# EAGLE design MainBoard (EAGLE 8.4.0)
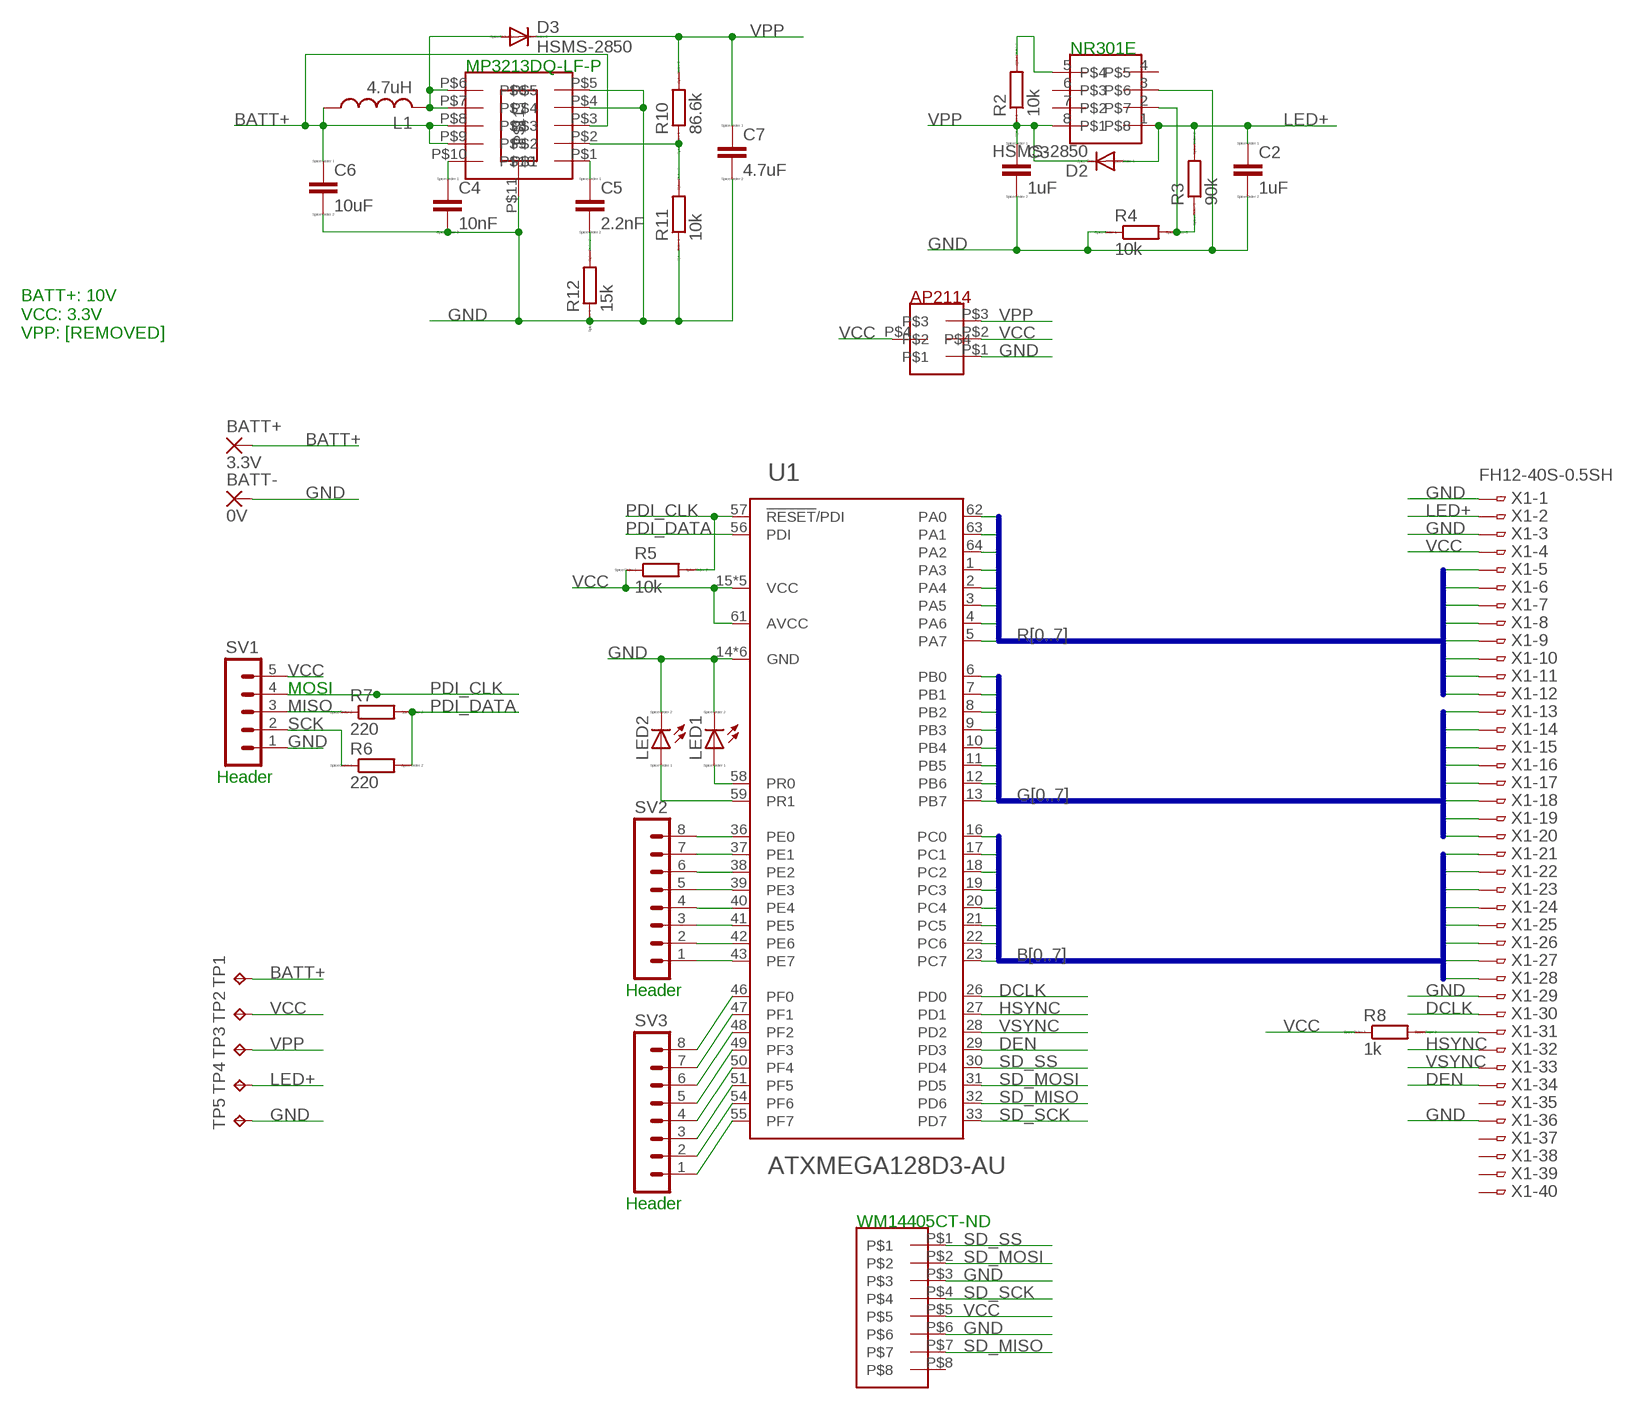
[diagram p0: schematic, sheet 1]

## Parts
BATT+  3.3V  2,54/1,1  [2,54/1,1]
BATT-  0V  2,54/1,1  [2,54/1,1]
C2  1uF  CC0402  [C0402]
C3  1uF  CC0402  [C0402]
C4  10nF  CC0402  [C0402]
C5  2.2nF  CC0402  [C0402]
C6  10uF  CC0402  [C0402]
C7  4.7uF  CC0402  [C0402]
D2  HSMS-2850  [SOT23]
D3  HSMS-2850  [SOT23]
L1  4.7uH  L-USL3225M  [L3225M]
LED1  LED_ESML0603  [LED_SML0603]
LED2  LED_ESML0603  [LED_SML0603]
R2  10k  RR0402  [R0402]
R3  90k  RR0402  [R0402]
R4  10k  RR0402  [R0402]
R5  10k  RR0402  [R0402]
R6  220  RR0402  [R0402]
R7  220  RR0402  [R0402]
R8  1k  RR0402  [R0402]
R10  86.6k  RR0402  [R0402]
R11  10k  RR0402  [R0402]
R12  15k  RR0402  [R0402]
SV1  MA05-1  [MA05-1]
SV2  MA08-1  [MA08-1]
SV3  MA08-1  [MA08-1]
TP1  TPPAD1-17  [P1-17]
TP2  TPPAD1-17  [P1-17]
TP3  TPPAD1-17  [P1-17]
TP4  TPPAD1-17  [P1-17]
TP5  TPPAD1-17  [P1-17]
U1  ATXMEGA128D3-AU  [TQFP-64A-64]
U$1  SOIC-8  [SOIC-8]
U$2  AP2114H  [SOT233]
U$3  MICROSD  [MICROSD]
U$4  QFN-10  [QFN-10]
X1  FH12-40S-0.5SH  [FH12-40S-0.5SH]

## Nets
B0: U1.16(PC0) X1.21
B1: U1.17(PC1) X1.22
B2: U1.18(PC2) X1.23
B3: U1.19(PC3) X1.24
B4: U1.20(PC4) X1.25
B5: U1.21(PC5) X1.26
B6: U1.22(PC6) X1.27
B7: U1.23(PC7) X1.28
BATT+: BATT+.1(P) C6.1 L1.1 TP1.TP U$4.P$3 U$4.P$8 U$4.P$9
DCLK: U1.26(PD0) X1.30
DEN: U1.29(PD3) X1.34
G0: U1.6(PB0) X1.13
G1: U1.7(PB1) X1.14
G2: U1.8(PB2) X1.15
G3: U1.9(PB3) X1.16
G4: U1.10(PB4) X1.17
G5: U1.11(PB5) X1.18
G6: U1.12(PB6) X1.19
G7: U1.13(PB7) X1.20
GND: BATT-.1(P) C2.2 C3.2 C4.2 C6.2 C7.2 LED1.C LED2.C R4.1 R11.1 R12.1 SV1.1 TP5.TP U1.14(GND) U1.24(GND) U1.34(GND) U1.44(GND) U1.52(GND) U1.60(GND) U$1.3 U$2.P$1 U$3.P$3 U$3.P$6 U$4.P$4 U$4.P$5 U$4.P$11 X1.1 X1.3 X1.29 X1.36
HSYNC: U1.27(PD1) X1.32
LED+: C2.1 D2.1(A) R3.2 TP4.TP U$1.1 X1.2
MISO: R7.1 SV1.3
N$3: R2.2 U$1.5
N$4: R3.1 R4.2 U$1.2
N$5: SV2.8 U1.36(PE0)
N$6: SV2.7 U1.37(PE1)
N$7: SV2.6 U1.38(PE2)
N$8: SV2.5 U1.39(PE3)
N$9: SV2.4 U1.40(PE4)
N$10: SV2.3 U1.41(PE5)
N$11: SV2.2 U1.42(PE6)
N$12: SV2.1 U1.43(PE7)
N$13: LED1.A U1.58(PR0)
N$14: LED2.A U1.59(PR1)
N$15: D3.1(A) L1.2 U$4.P$6 U$4.P$7
N$17: R8.2 X1.31
N$18: SV3.8 U1.46(PF0)
N$19: SV3.7 U1.47(PF1)
N$20: SV3.6 U1.48(PF2)
N$21: SV3.5 U1.49(PF3)
N$22: SV3.4 U1.50(PF4)
N$23: SV3.3 U1.51(PF5)
N$24: SV3.2 U1.54(PF6)
N$25: SV3.1 U1.55(PF7)
N$27: C4.1 U$4.P$10
N$28: R10.1 R11.2 U$4.P$2
N$30: C5.1 U$4.P$1
N$31: C5.2 R12.2
PDI_CLK: R5.2 SV1.4 U1.57(!RESET!/PDI)
PDI_DATA: R6.2 R7.2 U1.56(PDI)
R0: U1.62(PA0) X1.5
R1: U1.63(PA1) X1.6
R2: U1.64(PA2) X1.7
R3: U1.1(PA3) X1.8
R4: U1.2(PA4) X1.9
R5: U1.3(PA5) X1.10
R6: U1.4(PA6) X1.11
R7: U1.5(PA7) X1.12
SCK: R6.1 SV1.2
SD_MISO: U1.32(PD6) U$3.P$7
SD_MOSI: U1.31(PD5) U$3.P$2
SD_SCK: U1.33(PD7) U$3.P$4
SD_SS: U1.30(PD4) U$3.P$1
VCC: R5.1 R8.1 SV1.5 TP2.TP U1.15(VCC) U1.25(VCC) U1.35(VCC) U1.45(VCC) U1.53(VCC) U1.61(AVCC) U$2.P$2 U$2.P$4 U$3.P$5 X1.4
VPP: C3.1 C7.1 D2.3(C) D3.3(C) R2.1 R10.2 TP3.TP U$1.8 U$2.P$3
VSYNC: U1.28(PD2) X1.33
Unconnected: U$1.4 U$1.6 U$1.7 U$3.P$8 X1.35 X1.37 X1.38 X1.39 X1.40

## Buses
R[0..7]
G[0..7]
B[0..7]

## Notes on the sheet
- NR301E
- MP3213DQ-LF-P
- BATT+: 10V
  VCC: 3.3V
  VPP: [REMOVED]
- MOSI
- Header
- Header
- Header
- WM14405CT-ND

## Library data of the parts
BATT+ BATT- = wirepad:2,54/1,1: THROUGH-HOLE PAD
C2-C7 = eagle-ltspice:C: CAPACITOR, European symbol; SPICEMODEL: NONE; SPICEPREFIX: C
D2 D3 = avago:HSMS-2850: Surface Mount Microwave Schottky Detector Diodes Source: Data sheet <http://www.farnell.com/datasheets/461166.pdf>
L1 = resistor:L-US: INDUCTOR, American symbol
LED1 LED2 = eagle-ltspice:LED_E: LED Source: http://www.osram.convergy.de Source: www.luxeon.com Source: www.kingbright.com; SPICEMODEL: NONE; SPICEPREFIX: D; SPICETYPE: diode
R2-R8 R10-R12 = eagle-ltspice:R: RESISTOR, European symbol; SPICEMODEL: NONE; SPICEPREFIX: R
SV1 = con-lstb:MA05-1: PIN HEADER; OC_FARNELL: unknown; OC_NEWARK: unknown
SV2 SV3 = con-lstb:MA08-1: PIN HEADER; OC_FARNELL: unknown; OC_NEWARK: unknown
TP1-TP5 = testpad:TP: Test pad
U1 = atmel-xmega:ATXMEGA128D3: 8/16-bit XMEGA C3 Microcontroller Features High-performance, Low-power 8/16-bit Atmel® AVR® XMEGATM Microcontroller Non-volatile Program and Data Memories – 64K - 256K Bytes of In-System Self-Programmable Flash – 4K - 8K Bytes Boot Code Section with Independent Lock Bits – 2K - 4K Bytes EEPROM – 4K - 16K Bytes Internal SRAM Peripheral Features – Four-channel Event System – Five 16-bit Timer/Counters Four Timer/Counters with 4 Output Compare or Input Capture channels One Timer/Counters with 2 Output Compare or Input Capture channels High Resolution Extensions on two Timer/Counters Advanced Waveform Extension on one Timer/Counter – Three USARTs IrDA Extension on 1 USART – Two Two-Wire Interfaces with dual address match(I2C and SMBus compatible) – Two SPI (Serial Peripheral Interfaces) – 16-bit Real Time Counter with Separate Oscillator – One Sixteen-channel, 12-bit, 200ksps Analog to Digital Converter – Two Analog Comparators with Window compare function – External Interrupts on all General Purpose I/O pins – Programmable Watchdog Timer with Separate On-chip Ultra Low Power Oscillator Special Microcontroller Features – Power-on Reset and Programmable Brown-out Detection – Internal and External Clock Options with PLL – Programmable Multi-level Interrupt Controller – Sleep Modes: Idle, Power-down, Standby, Power-save, Extended Standby – Advanced Programming, Test and Debugging Interface PDI (Program and Debug Interface) for programming, test and debugging I/O and Packages – 50 Programmable I/O Lines – 64-lead TQFP – 64-pad QFN Operating Voltage – 1.6 – 3.6V Speed performance – 0 – 12 MHz @ 1.6 – 3.6V – 0 – 32 MHz @ 2.7 – 3.6V
U$1 = smd-footprints:SOIC-8
U$2 = ElectronicBadge:AP2114H
U$3 = ElectronicBadge:MICROSD
U$4 = smd-footprints:QFN-10
X1 = con-hirose:FH12-40S-0.5S: 0.5mm Pitch Connectors For FPC/FFC Source: Data sheet <http://www.hirose.co.jp/cataloge_hp/e58605370.pdf>; MPN: FH12-40S-0.5SH(55); OC_FARNELL: 1324556; OC_NEWARK: 34M6178

## Board
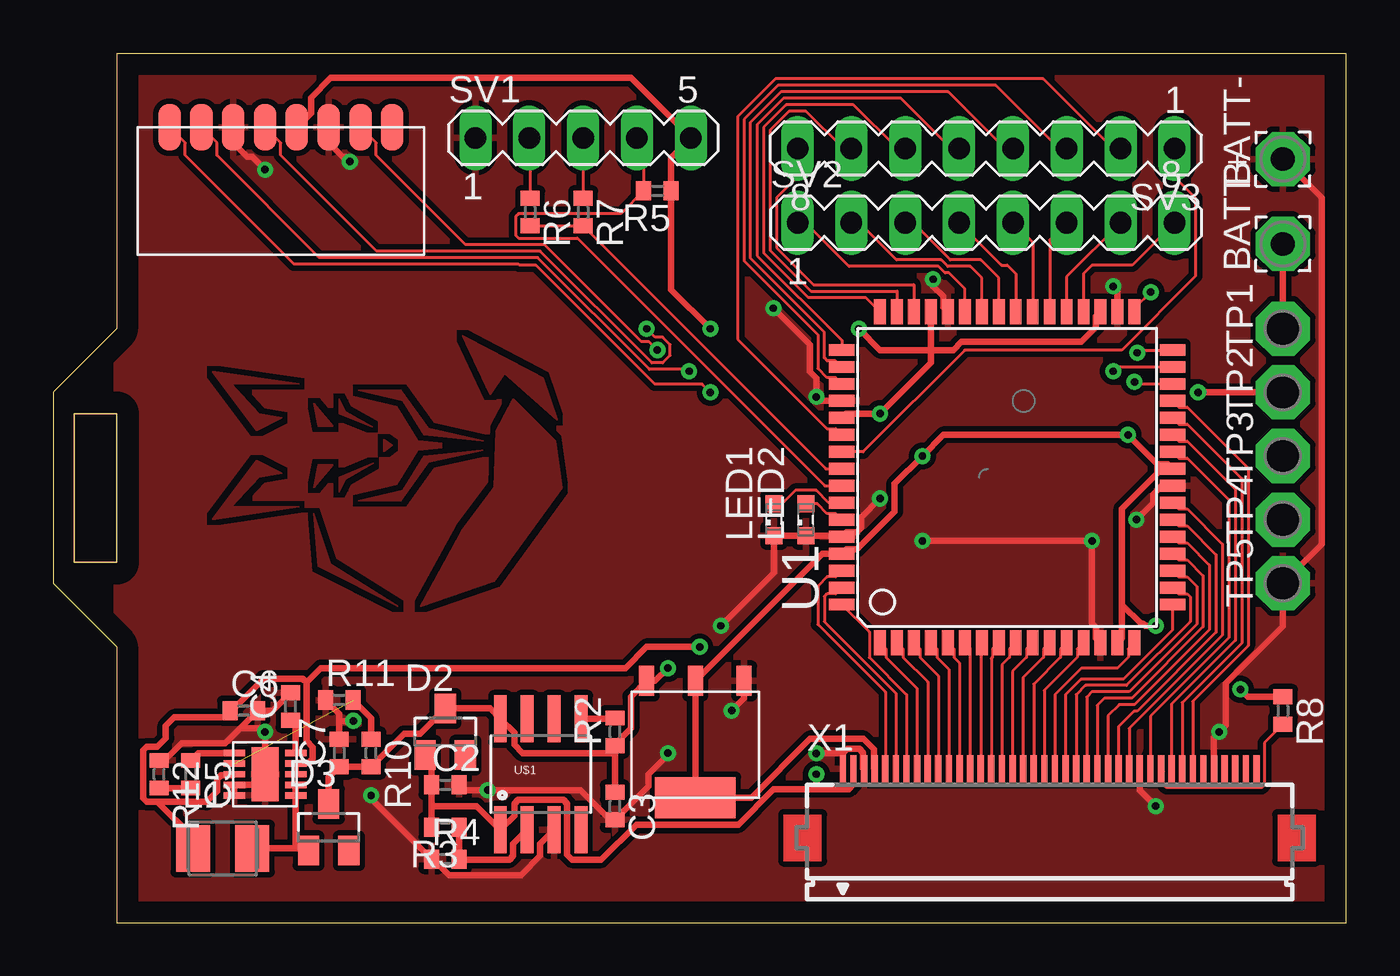
[diagram p1: board, top side]
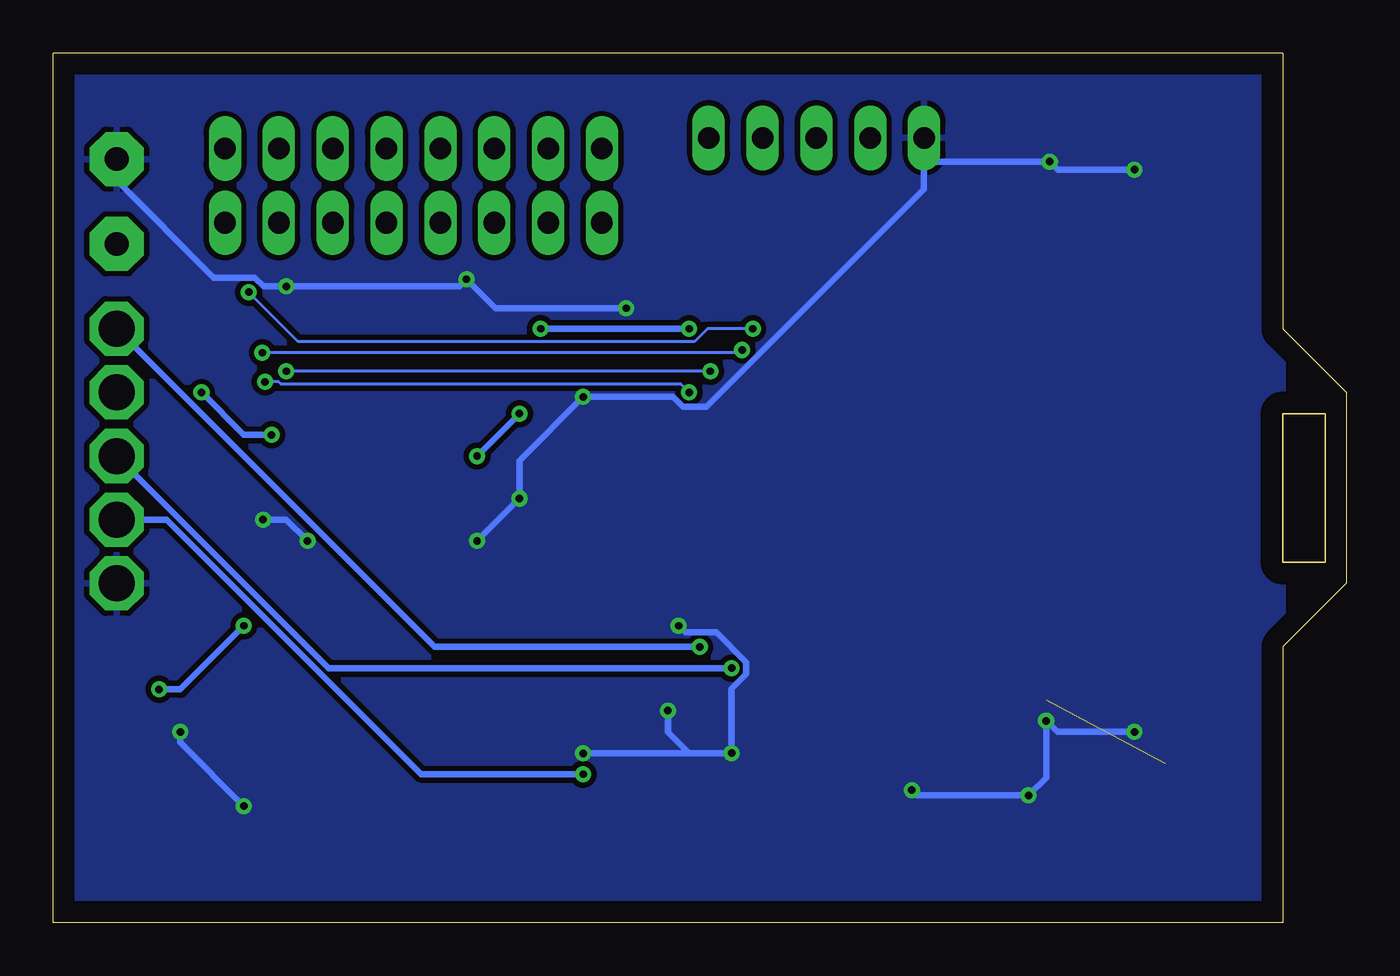
[diagram p2: board, bottom side, seen from below]

Size 61 x 41 mm. Coordinates in mm from the lower left corner, seen from the top.
Outline: 3,0 61,0 61,41 3,41 3,28 0,25 0,16 3,13 3,0
Outline: 1,24 1,17 3,17 3,24 1,24
Copper layers (1*16): Top 0.035mm / dielectric 1.5mm / Bottom 0.035mm
Design rules "default": minimum track width 6mil, minimum drill 0.35mm, track to track 6mil, track to pad 6mil, pad to pad 6mil, via to via 6mil, smd to smd 6mil, copper to edge 40mil, drill to drill 6mil, minimum pad ring 10mil, minimum via ring 8mil, stop-mask expansion 4mil, vias tented up to drill 0mil, thermal gap 10mil

### Footprints (pad centres in the part's own frame; a part is rotated, then mirrored left to right if it is on the bottom)
2,54/1,1 = drill 1.118 pad 2.54 octagon: 1 0,0
C0402 = smd 0.7 x 0.9: 1 -0.65,0; 2 0.65,0
SOT23 = smd 1 x 1.4: 1 -0.95,-1.1; 2 0.95,-1.1; 3 0,1.1
L3225M = smd 1.6 x 2.2: 1 -1.4,0; 2 1.4,0
LED_SML0603 = smd 0.8 x 0.8: A 0.75,0; C -0.75,0
R0402 = smd 0.7 x 0.9: 1 -0.65,0; 2 0.65,0
MA05-1 = drill 1.016 long: 1 -5.08,0; 2 -2.54,0; 3 0,0; 4 2.54,0; 5 5.08,0
MA08-1 = drill 1.016 long: 1 -8.89,0; 2 -6.35,0; 3 -3.81,0; 4 -1.27,0; 5 1.27,0; 6 3.81,0; 7 6.35,0; 8 8.89,0
P1-17 = drill 1.702 pad 2.54 octagon: TP 0,0
TQFP-64A-64 = smd 1.194 x 0.559: 1 -7.8,6; 2 -7.8,5.2; 3 -7.8,4.4; 4 -7.8,3.6; 5 -7.8,2.8; 6 -7.8,2; 7 -7.8,1.2; 8 -7.8,0.4; 9 -7.8,-0.4; 10 -7.8,-1.2; 11 -7.8,-2; 12 -7.8,-2.8; 13 -7.8,-3.6; 14 -7.8,-4.4; 15 -7.8,-5.2; 16 -7.8,-6; 33 7.8,-6; 34 7.8,-5.2; 35 7.8,-4.4; 36 7.8,-3.6; 37 7.8,-2.8; 38 7.8,-2; 39 7.8,-1.2; 40 7.8,-0.4; 41 7.8,0.4; 42 7.8,1.2; 43 7.8,2; 44 7.8,2.8; 45 7.8,3.6; 46 7.8,4.4; 47 7.8,5.2; 48 7.8,6 | smd 0.559 x 1.194: 17 -6,-7.8; 18 -5.2,-7.8; 19 -4.4,-7.8; 20 -3.6,-7.8; 21 -2.8,-7.8; 22 -2,-7.8; 23 -1.2,-7.8; 24 -0.4,-7.8; 25 0.4,-7.8; 26 1.2,-7.8; 27 2,-7.8; 28 2.8,-7.8; 29 3.6,-7.8; 30 4.4,-7.8; 31 5.2,-7.8; 32 6,-7.8; 49 6,7.8; 50 5.2,7.8; 51 4.4,7.8; 52 3.6,7.8; 53 2.8,7.8; 54 2,7.8; 55 1.2,7.8; 56 0.4,7.8; 57 -0.4,7.8; 58 -1.2,7.8; 59 -2,7.8; 60 -2.8,7.8; 61 -3.6,7.8; 62 -4.4,7.8; 63 -5.2,7.8; 64 -6,7.8
SOIC-8 = smd 0.61 x 2.21: 1 -1.905,-2.616; 2 -0.635,-2.616; 3 0.635,-2.616; 4 1.905,-2.616; 5 1.905,2.616; 6 0.635,2.616; 7 -0.635,2.616; 8 -1.905,2.616
SOT233 = smd 0.711 x 1.422: P$1 -2.3,-4.5; P$2 0,-4.5; P$3 2.3,-4.5 | smd 3.81 x 1.93: P$4 0,1
MICROSD = smd 1.067 x 2.184: P$1 0,0; P$2 1.5,0; P$3 3,0; P$4 4.5,0; P$5 6,0; P$6 7.5,0; P$7 9,0; P$8 10.5,0
QFN-10 = smd 1 x 0.305: P$1 -1.45,1; P$2 -1.45,0.5; P$3 -1.45,0; P$4 -1.45,-0.5; P$5 -1.45,-1; P$6 1.45,-1; P$7 1.45,-0.5; P$8 1.45,0; P$9 1.45,0.5; P$10 1.45,1 | smd 1.27 x 2.54: P$11 0,0
FH12-40S-0.5SH = smd 0.3 x 1.3: 1 -9.75,3.25; 2 -9.25,3.25; 3 -8.75,3.25; 4 -8.25,3.25; 5 -7.75,3.25; 6 -7.25,3.25; 7 -6.75,3.25; 8 -6.25,3.25; 9 -5.75,3.25; 10 -5.25,3.25; 11 -4.75,3.25; 12 -4.25,3.25; 13 -3.75,3.25; 14 -3.25,3.25; 15 -2.75,3.25; 16 -2.25,3.25; 17 -1.75,3.25; 18 -1.25,3.25; 19 -0.75,3.25; 20 -0.25,3.25; 21 0.25,3.25; 22 0.75,3.25; 23 1.25,3.25; 24 1.75,3.25; 25 2.25,3.25; 26 2.75,3.25; 27 3.25,3.25; 28 3.75,3.25; 29 4.25,3.25; 30 4.75,3.25; 31 5.25,3.25; 32 5.75,3.25; 33 6.25,3.25; 34 6.75,3.25; 35 7.25,3.25; 36 7.75,3.25; 37 8.25,3.25; 38 8.75,3.25; 39 9.25,3.25; 40 9.75,3.25

### Placement (x,y rotation side)
BATT+  58,32 90 top
BATT-  58,36 90 top
C2  18.5,6.5 0 top
C3  26.5,5.5 270 top
C4  11.2,10.2 90 top
C5  6.5,7 270 top
C6  9,10 0 top
C7  13.5,8 90 top
D2  18.5,9 0 top
D3  13,4.5 0 top
L1  8,3.5 0 top
LED1  34,19 90 top
LED2  35.5,19 90 top
R2  26.5,9 90 top
R3  18.5,4.5 180 top
R4  18.5,3 0 top
R5  28.5,34.5 180 top
R6  22.5,33.5 270 top
R7  25,33.5 270 top
R8  58,10 270 top
R10  15,8 270 top
R11  13.5,10.5 0 top
R12  5,7 270 top
SV1  25,37 0 top
SV2  44,33 0 top
SV3  44,36.5 180 top
TP1  58,28 90 top
TP2  58,25 90 top
TP3  58,22 90 top
TP4  58,19 90 top
TP5  58,16 90 top
U1  45,21 90 top
U$1  23,7 0 top
U$2  30.29,6.9 180 top
U$3  5.5,37.5 0 top
U$4  10,7 0 top
X1  47,4 0 top

### Tracks (layer width: path | path; a pad name or v marks a point on that pad's centre or on a via)
B0
  Top 0.152: U1.16 50.71,12.91 50.71,12.51 50.2,12 48.5,12 47.25,10.75 X1.21
B1
  Top 0.152: X1.22 47.75,10.75 48.5,11.5 50.5,11.5 52.8,13.8 U1.17
B2
  Top 0.152: U1.18 53.09,15.51 53.49,15.51 53.63,15.37 53.63,14.2 50.63,11.2 48.7,11.2 48.25,10.75 X1.23
B3
  Top 0.152: U1.19 53.09,16.31 53.49,16.31 53.93,15.87 53.93,14.07 50.75,10.89 49,10.89 48.75,10.64 X1.24
B4
  Top 0.152: U1.20 53.09,17.11 53.49,17.11 54.23,16.36 54.23,13.94 50.88,10.59 49.59,10.59 49.25,10.25 X1.25
B5
  Top 0.152: U1.21 53.09,17.91 53.49,17.91 54.54,16.86 54.54,13.82 51.01,10.28 50.28,10.28 49.75,9.75 X1.26
B6
  Top 0.152: U1.22 53.09,18.71 53.49,18.71 54.84,17.36 54.84,13.69 51.13,9.98 50.98,9.98 50.25,9.25 X1.27
B7
  Top 0.152: X1.28 50.75,9.16 55.15,13.56 55.15,17.85 53.49,19.51 53.09,19.51 U1.23
BATT+  (via drill 0.35)
  Top 0.305: 11.96,11.33 11.78,11.51 9.92,11.51 8.42,10 C6.1 8.03,9.68 5.72,9.68 5.32,9.28 5.32,8.7 4.92,8.3 4.42,8.3 4.25,8.13 4.25,5.87 4.42,5.7 4.92,5.7 | L1.1 6.6,4.02 4.92,5.7 | 11.96,11.33 12.63,12 27,12 28,13 v30.5,13 | BATT+.1 TP1.TP | U$4.P$3 8.51,6.96 7.92,6.96 7.75,6.78 7.75,6.2 7.25,5.7 4.92,5.7 | U$4.P$8 U$4.P$9 11.49,7.54 12.08,7.54 12.26,7.72 12.26,8.28 11.96,8.58 11.96,11.33
  Bottom 0.305: TP1.TP 43,13 v30.5,13
DCLK
  Top 0.152: X1.30 51.75,9.73 55.45,13.44 55.45,19.95 53.49,21.91 53.09,21.91 U1.26
DEN
  Top 0.152: U1.29 53.09,24.31 53.49,24.31 56.37,21.43 56.37,13.06 53.75,10.44 X1.34
G0
  Top 0.152: U1.6 43.25,12.95 X1.13
G1
  Top 0.152: U1.7 43.75,13.15 X1.14
G2
  Top 0.152: U1.8 44.31,12.91 44.31,12.51 44.25,12.45 X1.15
G3
  Top 0.152: U1.9 45.11,12.91 45.11,12.51 44.75,12.15 X1.16
G4
  Top 0.152: U1.10 45.91,12.91 45.91,12.51 45.25,11.85 X1.17
G5
  Top 0.152: U1.11 46.71,12.91 46.71,12.51 45.75,11.55 X1.18
G6
  Top 0.152: U1.12 47.51,12.91 47.51,12.51 46.25,11.25 X1.19
G7
  Top 0.152: U1.13 48.31,12.91 48.31,12.51 46.75,10.95 X1.20
GND  (via drill 0.35)
  Top 0.305: X1.3 38.21,7.29 38.21,8.02 38.03,8.21 37.47,8.21 37.25,7.98 | BATT-.1 59.83,34.17 59.83,17.83 TP5.TP 58,13.97 55.32,11.28 55.32,9.32 v55,9 54.75,8.75 X1.36 | U1.52 36.19,24.6 v36,24.79 36,25.66 35.69,25.97 35.69,27.25 v33.97,28.97 | v14,35.88 13.77,36.1 13.66,36.1 13,36.77 U$3.P$6 | 8.82,9.18 C6.2 10.35,10 C4.2 | 8.82,9.18 8.11,8.46 6.08,8.46 5.27,7.65 R12.1 | U$4.P$5 U$4.P$4 9.5,6.5 U$4.P$11 v10,9 9.82,9.18 8.82,9.18 | v15,6 15,5.85 R4.1 17.92,3 18.67,2.25 22.07,2.25 22.98,3.15 22.98,3.72 U$1.3 | C2.2 19.4,6.25 v20.5,6.25 24.88,6.25 26.28,4.85 C3.2 28.08,6.43 28.08,6.99 29,7.91 v29,8 | 37.25,7.98 v36,7.98 | v36,7.98 | U$2.P$1 32.59,10.59 v32,10 | v31.5,14 34,16.5 LED1.C LED2.C 37.15,18.25 U1.60 37.42,18.42 37.92,18.42 38.1,18.59 38.1,19.1 v39,20 | X1.29 51.25,6.25 v52,5.5 | v10,35.5 9.4,36.1 9.16,36.1 8.5,36.77 U$3.P$3 | U1.14 49.18,13.42 49.18,13.92 49,14.11 v49,18 v41,18 | v51.1,19 51.9,19.8 51.9,20.21 52.29,20.6 U1.24 | U1.44 41.98,29.02 41.98,29.52 41.5,30.01 v41.5,30.34 | v50,30 50.2,29.8 U1.34 | X1.1 37.25,7.98 | R11.1 13.5,9.85 13.5,9.5 | 13.5,9.5 C7.2 | v14.16,9.52 14.14,9.5 13.5,9.5
  Bottom 0.305: 19.92,36 19.92,34.58 30.18,24.32 31.28,24.32 31.75,24.79 v36,24.79 39,21.79 v39,20 v41,18 | 19.92,36 SV1.1 | 13.88,36 v14,35.88 | v14,35.88 19.8,35.88 19.92,36 | v20.5,6.25 20.25,6 v15,6 14.16,6.83 v14.16,9.52 13.64,9 v10,9 | 31,7.98 v36,7.98 | 31,7.98 29.02,7.98 v29,8 29,11.03 28.32,11.72 28.32,12.28 29.72,13.68 31.18,13.68 v31.5,14 | v32,10 32,8.98 31,7.98 | v52,5.5 55,8.5 v55,9 | v14,35.88 13.62,35.5 v10,35.5 | v49,18 50,19 v51.1,19 | BATT-.1 58,35 53.41,30.41 51.49,30.41 51.08,30 v50,30 41.84,30 v41.5,30.34 40.13,28.97 v33.97,28.97
  pour Top (isolate 0.254, rank 3): 3,41 61,41 61,0 3,0
  pour Bottom (isolate 0.254): 61,41 3,41 3,0 61,0
HSYNC
  Top 0.152: X1.32 52.75,10.3 55.76,13.31 55.76,20.44 53.49,22.71 53.09,22.71 U1.27
LED+  (via drill 0.35)
  Top 0.305: D2.1 17.85,7.6 C2.1 17.85,5.5 | 17.85,5.5 R3.2 | 17.85,5.5 19.98,5.5 U$1.1 21.75,5.04 21.75,5.62 21.93,5.79 24.07,5.79 24.25,5.62 24.25,3.2 24.47,2.97 25.86,2.97 27.51,4.63 32.32,4.63 33.99,6.29 36,6.29 | 36,6.29 37.53,6.29 37.75,6.52 X1.2 | v36,7 36,6.29
  Bottom 0.305: TP4.TP 55.65,19 43.65,7 v36,7
MISO
  Top 0.152: SV1.3 R7.1
N$3
  Top 0.305: R2.2 26.47,9.62 U$1.5
N$4
  Top 0.305: R3.1 R4.2 19.18,2.97 21.53,2.97 21.7,3.15 21.7,3.72 U$1.2
N$5
  Top 0.152: SV2.8 50.89,31 49,31 48.6,30.6 U1.36
N$6
  Top 0.152: SV2.7 47.8,30.45 U1.37
N$7
  Top 0.152: SV2.6 47,32.19 U1.38
N$8
  Top 0.152: SV2.5 46.2,32.07 U1.39
N$9
  Top 0.152: SV2.4 44.73,31 45,31 45.4,30.6 U1.40
N$10
  Top 0.152: U1.41 44.6,30.4 43.75,31.25 42.32,31.25 40.57,33 SV2.3
N$11
  Top 0.152: U1.42 43.8,30.39 43.25,30.94 42.19,30.94 41.89,31.25 39.78,31.25 38.03,33 SV2.2
N$12
  Top 0.152: U1.43 43,29.89 42.25,30.64 42.07,30.64 41.76,30.94 37.54,30.94 35.49,33 SV2.1
N$13
  Top 0.152: LED1.A 34.38,19.75 35.01,20.38 35.99,20.38 36.57,19.8 U1.58
N$14
  Top 0.152: U1.59 36.91,19.29 36.51,19.29 36.05,19.75 LED2.A
N$15
  Top 0.305: U$4.P$7 U$4.P$6 11.45,3.55 11.5,3.5 | 11.5,3.5 L1.2 | 11.5,3.5 11.95,3.5 D3.1
N$17
  Top 0.152: R8.2 57.13,8.48 57.13,6.5 56.99,6.37 52.51,6.37 52.37,6.5 52.37,7.13 X1.31
N$18
  Top 0.152: U1.46 40.6,30.09 35.86,30.09 34.12,31.83 34.12,34.17 35.11,35.16 SV3.8
N$19
  Top 0.152: U1.47 39.8,29.78 35.73,29.78 33.81,31.7 33.81,37.37 34.7,38.25 35.52,38.25 37.27,36.5 SV3.7
N$20
  Top 0.152: U1.48 38.32,29.48 35.61,29.48 33.51,31.57 33.51,37.49 34.57,38.56 37.76,38.56 39.81,36.5 SV3.6
N$21
  Top 0.152: U1.49 37.2,27.45 33.2,31.45 33.2,37.62 34.45,38.86 39.99,38.86 42.35,36.5 SV3.5
N$22
  Top 0.152: SV3.4 44.89,36.5 42.23,39.17 34.32,39.17 32.9,37.75 32.9,31.32 36.37,27.85 36.37,26.63 36.51,26.49 36.91,26.49 U1.50
N$23
  Top 0.152: SV3.3 47.43,36.5 44.46,39.47 34.2,39.47 32.59,37.87 32.59,33 | 32.59,33 32.59,32.6 | U1.51 36.91,25.69 36.51,25.69 36.07,26.13 36.07,27.72 32.59,31.2 32.59,33
N$24
  Top 0.152: SV3.2 49.97,36.5 46.7,39.78 34.07,39.78 32.29,38 32.29,27.51 36.51,23.29 36.91,23.29 U1.54
N$25
  Top 0.152: SV3.1 52.89,35.16 53.88,34.17 53.88,30.48 50.4,27 43,27 38.2,22.2 U1.55
N$27
  Top 0.305: 11.25,9.5 C4.1 11.45,9.3 U$4.P$10
N$28  (1 unrouted)
  Top 0.305: R11.2 15,9.65 R10.1
N$30
  Top 0.305: C5.1 6.85,8 U$4.P$1
N$31
  Top 0.305: R12.2 C5.2
PDI_CLK
  Top 0.152: SV1.4 27.85,36.69 R5.2 26.78,33.43 21.95,33.43 21.82,33.3 21.82,32.41 21.95,32.27 24.73,32.27 36.4,20.6 U1.57
PDI_DATA
  Top 0.152: R6.2 R7.2 36.45,21.4 U1.56
R0
  Top 0.152: X1.5 39.25,10.89 36.07,14.07 36.07,15.87 36.51,16.31 36.91,16.31 U1.62
R1
  Top 0.152: X1.6 39.75,10.82 36.37,14.2 36.37,15.37 36.51,15.51 36.91,15.51 U1.63
R2
  Top 0.152: U1.64 38.49,13.71 38.49,12.51 40.25,10.75 X1.7
R3
  Top 0.152: U1.1 39.29,12.91 39.29,12.51 40.75,11.05 X1.8
R4
  Top 0.152: U1.2 40.09,12.91 40.09,12.51 41.25,11.35 X1.9
R5
  Top 0.152: U1.3 40.89,12.91 40.89,12.51 41.75,11.65 X1.10
R6
  Top 0.152: U1.4 41.69,12.91 41.69,12.51 42.25,11.95 X1.11
R7
  Top 0.152: U1.5 42.49,12.91 42.49,12.51 42.75,12.25 X1.12
S$1
  pour Top: 7.5,19 9.6,21.8 10.8,21.2 9.7,21 8.4,19.6 11.6,19.6
S$2
  pour Top: 12.3,20.5 12.5,21.6 13.2,21.6
S$3
  pour Top: 13.5,20.3 13.5,21 15.2,21.7 13.8,20.9
S$4
  pour Top: 15.6,22.2 15.6,22.8 16,22.5
S$5
  pour Top: 14.4,19.9 16.5,20.4 17.5,22 20.4,22.3 17.7,21.7 16.4,19.9
S$6
  pour Top: 12.3,19.3 13.1,16.9 16.3,14.9 12.5,16.8
S$7
  pour Top: 17.3,14.9 19.3,18.5 20.8,20.5 20.9,23.2 21.7,24.7 23.7,22.7 24,20.5 20.8,16.1
S$8
  pour Top: 7.5,26 9.6,23.2 10.8,23.8 9.7,24 8.4,25.4 11.6,25.4
S$9
  pour Top: 12.3,24.5 12.5,23.4 13.2,23.4
S$10
  pour Top: 13.5,24.7 13.5,24 15.2,23.3 13.8,24.1
S$11
  pour Top: 14.4,25.1 16.5,24.6 17.5,23 20.4,22.7 17.7,23.3 16.4,25.1
S$12
  pour Top: 20.6,24.9 19.3,27.7 23.1,25.7 23.8,23.7 21.3,25.9
SCK
  Top 0.152: SV1.2 22.5,36.96 R6.1
SD_MISO  (via drill 0.35)
  Top 0.152: v51.13,26.87 51.26,27 U1.32 | v28.5,27 28.11,27.39 27.75,27.39 23.18,31.97 19.45,31.97 15.24,36.18 15.24,36.76 U$3.P$7
  Bottom 0.152: v28.5,27 28.63,26.87 v51.13,26.87
SD_MOSI  (via drill 0.35)
  Top 0.152: v50,26 50.2,26.2 U1.31 | v30,26 29.91,26.09 28.12,26.09 22.85,31.36 19.7,31.36 | 19.7,31.36 | 19.7,31.36 12.56,31.36 7.74,36.18 7.74,36.76 U$3.P$2
  Bottom 0.152: v30,26 v50,26
SD_SCK  (via drill 0.35)
  Top 0.152: v28,28 28.39,27.61 28.75,27.61 29.11,27.25 29.11,26.75 28.75,26.39 28.25,26.39 22.98,31.66 19.58,31.66 | 19.58,31.66 | 19.58,31.66 15.26,31.66 10.74,36.18 10.74,36.76 U$3.P$4 | v51.77,29.73 51,28.96 U1.33
  Bottom 0.152: v28,28 30.14,28 30.75,27.39 49.44,27.39 v51.77,29.73
SD_SS  (via drill 0.35)
  Top 0.152: v51,25.5 51.1,25.4 U1.30 | v31,25 30.61,25.39 28.39,25.39 22.78,31 22,31 21.95,31.05 11.37,31.05 6.24,36.18 6.24,36.76 U$3.P$1
  Bottom 0.152: v51,25.5 50.36,25.5 50.25,25.39 31.39,25.39 v31,25
VCC  (via drill 0.35)
  Top 0.305: X1.4 38.71,7.29 38.71,8.17 38.22,8.66 35.71,8.66 32.95,5.9 U$2.P$4 U$2.P$2 36.29,17.4 U1.61 37.42,17.62 37.92,17.62 39.68,19.38 39.68,20.68 v41,22 42,23 v50.69,23 52.08,21.62 | U1.53 37.4,24 v39,24 41.4,26.4 41.4,27 | 41.4,27 U1.45 | U1.25 52.58,21.62 52.08,21.62 | U1.35 49.18,28.58 49.18,28.08 48.49,27.38 42.84,27.38 42.46,27 41.4,27 | TP2.TP v54,25 | U1.15 50.42,13.42 50.42,15 | 52.08,21.62 52.08,21.18 50.42,19.52 50.42,15 | 50.42,15 51.31,14.1 51.41,14.1 51.51,14 v52,14 | v56,11 56.35,10.65 R8.1 | U$3.P$5 12.16,38.16 12.16,38.9 13.1,39.83 27.25,39.83 SV1.5 29.15,36.07 R5.1 29.15,29.85 v31,28 | v38,28 39,27 41.4,27
  Bottom 0.305: v41,22 v39,24 | v54,25 52,23 v50.69,23 | v52,14 55,11 v56,11 | v31,28 v38,28
VPP  (via drill 0.35)
  Top 0.305: 26.5,8 C3.1 | 26.5,8 R2.1 26.5,8.42 27.25,9.17 27.25,10.66 U$2.P$3 28.4,11.4 v29,12 | 26.5,8 22.14,8 21.75,8.38 21.75,8.96 U$1.8 20.61,10.1 D2.3 17.3,8.9 16.55,8.9 R10.2 C7.1 13,6.85 D3.3
  Bottom 0.305: TP3.TP 48,12 v29,12
VSYNC
  Top 0.152: U1.28 53.09,23.51 53.49,23.51 56.06,20.94 56.06,13.19 53.25,10.37 X1.33

### Text on the board
tDocu: Rev 010